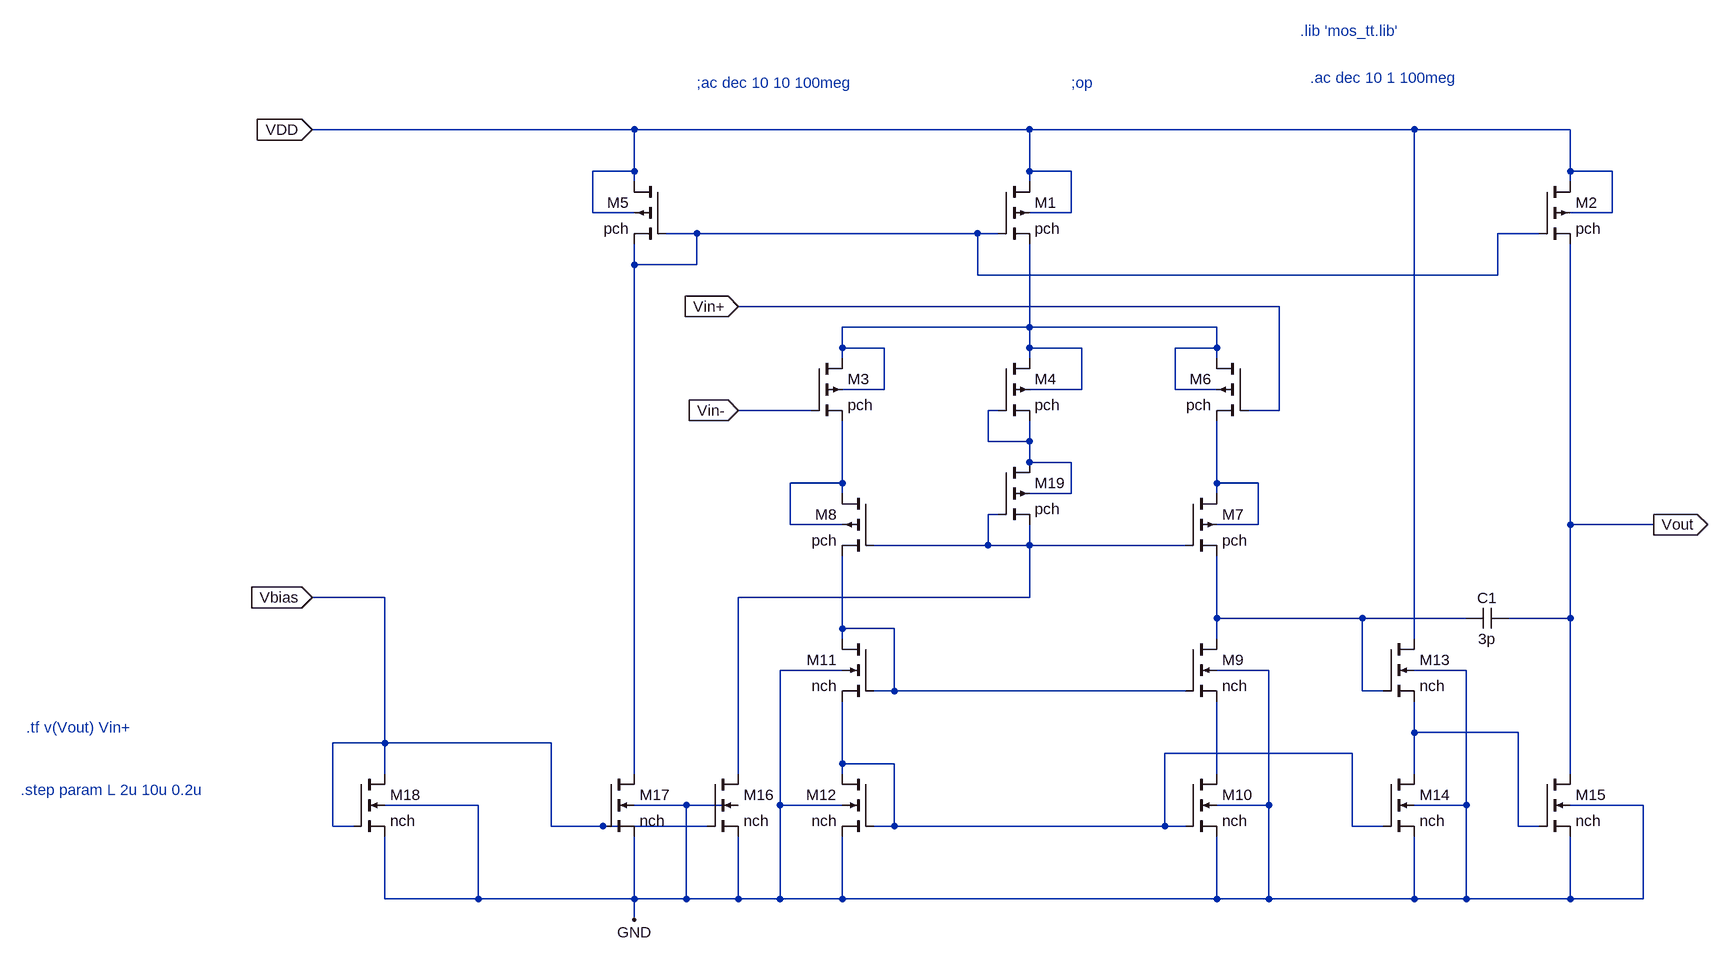
[diagram p0: schematic Opamp3u.asc]
Opamp3u.asc, the LTspice schematic file:
Version 4
SHEET 1 1400 868
WIRE -288 -368 -784 -368
WIRE 320 -368 -288 -368
WIRE 912 -368 320 -368
WIRE 1152 -368 912 -368
WIRE -288 -304 -288 -368
WIRE -288 -304 -352 -304
WIRE 320 -304 320 -368
WIRE 384 -304 320 -304
WIRE 1152 -304 1152 -368
WIRE 1216 -304 1152 -304
WIRE -288 -288 -288 -304
WIRE 320 -288 320 -304
WIRE 1152 -288 1152 -304
WIRE -352 -240 -352 -304
WIRE -288 -240 -352 -240
WIRE 384 -240 384 -304
WIRE 384 -240 320 -240
WIRE 1216 -240 1216 -304
WIRE 1216 -240 1152 -240
WIRE -192 -208 -240 -208
WIRE 240 -208 -192 -208
WIRE 272 -208 240 -208
WIRE 1104 -208 1040 -208
WIRE -288 -160 -288 -192
WIRE -192 -160 -192 -208
WIRE -192 -160 -288 -160
WIRE 240 -144 240 -208
WIRE 1040 -144 1040 -208
WIRE 1040 -144 240 -144
WIRE 704 -96 -128 -96
WIRE 320 -64 320 -192
WIRE 320 -64 32 -64
WIRE 608 -64 320 -64
WIRE 32 -32 32 -64
WIRE 96 -32 32 -32
WIRE 320 -32 320 -64
WIRE 400 -32 320 -32
WIRE 608 -32 608 -64
WIRE 608 -32 544 -32
WIRE 32 -16 32 -32
WIRE 320 -16 320 -32
WIRE 608 -16 608 -32
WIRE 96 32 96 -32
WIRE 96 32 32 32
WIRE 400 32 400 -32
WIRE 400 32 320 32
WIRE 544 32 544 -32
WIRE 608 32 544 32
WIRE -16 64 -128 64
WIRE 272 64 256 64
WIRE 704 64 704 -96
WIRE 704 64 656 64
WIRE 256 112 256 64
WIRE 320 112 320 80
WIRE 320 112 256 112
WIRE 320 144 320 112
WIRE 384 144 320 144
WIRE 32 176 32 80
WIRE 32 176 -48 176
WIRE 608 176 608 80
WIRE 672 176 608 176
WIRE 32 192 32 176
WIRE 384 192 384 144
WIRE 384 192 320 192
WIRE 608 192 608 176
WIRE 272 224 256 224
WIRE -48 240 -48 176
WIRE 32 240 -48 240
WIRE 672 240 672 176
WIRE 672 240 608 240
WIRE 1152 240 1152 -192
WIRE 1280 240 1152 240
WIRE 256 272 256 224
WIRE 256 272 80 272
WIRE 320 272 320 240
WIRE 320 272 256 272
WIRE 560 272 320 272
WIRE -672 352 -784 352
WIRE 320 352 320 272
WIRE 320 352 -128 352
WIRE 608 384 608 288
WIRE 832 384 608 384
WIRE 992 384 832 384
WIRE 1152 384 1152 240
WIRE 1152 384 1056 384
WIRE 32 400 32 288
WIRE 112 400 32 400
WIRE 32 416 32 400
WIRE 608 416 608 384
WIRE 912 416 912 -368
WIRE 32 464 -64 464
WIRE 688 464 608 464
WIRE 992 464 912 464
WIRE 112 496 112 400
WIRE 112 496 80 496
WIRE 560 496 112 496
WIRE 832 496 832 384
WIRE 864 496 832 496
WIRE 912 560 912 512
WIRE 1072 560 912 560
WIRE -672 576 -672 352
WIRE -672 576 -752 576
WIRE -416 576 -672 576
WIRE 816 592 528 592
WIRE 32 608 32 512
WIRE 112 608 32 608
WIRE -672 624 -672 576
WIRE -288 624 -288 -160
WIRE -128 624 -128 352
WIRE 32 624 32 608
WIRE 608 624 608 512
WIRE 912 624 912 560
WIRE 1152 624 1152 384
WIRE -528 672 -672 672
WIRE -208 672 -288 672
WIRE -128 672 -208 672
WIRE -64 672 -64 464
WIRE 32 672 -64 672
WIRE 688 672 688 464
WIRE 688 672 608 672
WIRE 992 672 992 464
WIRE 992 672 912 672
WIRE 1264 672 1152 672
WIRE -752 704 -752 576
WIRE -720 704 -752 704
WIRE -416 704 -416 576
WIRE -336 704 -416 704
WIRE -176 704 -336 704
WIRE 112 704 112 608
WIRE 112 704 80 704
WIRE 528 704 528 592
WIRE 528 704 112 704
WIRE 560 704 528 704
WIRE 816 704 816 592
WIRE 864 704 816 704
WIRE 1072 704 1072 560
WIRE 1104 704 1072 704
WIRE -672 816 -672 720
WIRE -528 816 -528 672
WIRE -528 816 -672 816
WIRE -288 816 -288 720
WIRE -288 816 -528 816
WIRE -208 816 -208 672
WIRE -208 816 -288 816
WIRE -128 816 -128 720
WIRE -128 816 -208 816
WIRE -64 816 -64 672
WIRE -64 816 -128 816
WIRE 32 816 32 720
WIRE 32 816 -64 816
WIRE 608 816 608 720
WIRE 608 816 32 816
WIRE 688 816 688 672
WIRE 688 816 608 816
WIRE 912 816 912 720
WIRE 912 816 688 816
WIRE 992 816 992 672
WIRE 992 816 912 816
WIRE 1152 816 1152 720
WIRE 1152 816 992 816
WIRE 1264 816 1264 672
WIRE 1264 816 1152 816
WIRE -288 848 -288 816
FLAG -288 848 GND
FLAG -128 64 Vin-
IOPIN -128 64 In
FLAG -128 -96 Vin+
IOPIN -128 -96 In
FLAG -784 -368 VDD
IOPIN -784 -368 In
FLAG 1280 240 Vout
IOPIN 1280 240 Out
FLAG -784 352 Vbias
IOPIN -784 352 In
SYMBOL pmos4 272 -288 R0
SYMATTR InstName M1
SYMATTR Value pch
SYMATTR Value2 l=3u w=150u ad=1.05e-9 as=1.05e-9 pd=164e-6 ps=164e-6
SYMBOL pmos4 1104 -288 R0
SYMATTR InstName M2
SYMATTR Value pch
SYMATTR Value2 l=3u w=150u ad=1.05e-9 as=1.05e-9 pd=164e-6 ps=164e-6 m=2
SYMBOL pmos4 -16 -16 R0
SYMATTR InstName M3
SYMATTR Value pch
SYMATTR Value2 l=3u w=75u ad=5.25e-10 as=5.25e-10 pd=89e-6 ps=89e-6
SYMBOL pmos4 272 -16 R0
SYMATTR InstName M4
SYMATTR Value pch
SYMATTR Value2 l=2u w=75u ad=5.25e-10 as=5.25e-10 pd=89e-6 ps=89e-6
SYMBOL pmos4 -240 -288 M0
SYMATTR InstName M5
SYMATTR Value pch
SYMATTR Value2 l=3u w=150u ad=1.05e-9 as=1.05e-9 pd=164e-6 ps=164e-6
SYMBOL pmos4 656 -16 M0
SYMATTR InstName M6
SYMATTR Value pch
SYMATTR Value2 l=3u w=75u ad=5.25e-10 as=5.25e-10 pd=89e-6 ps=89e-6
SYMBOL pmos4 560 192 R0
SYMATTR InstName M7
SYMATTR Value pch
SYMATTR Value2 l=4u w=75u ad=5.25e-10 as=5.25e-10 pd=89e-6 ps=89e-6
SYMBOL pmos4 80 192 M0
SYMATTR InstName M8
SYMATTR Value pch
SYMATTR Value2 l=4u w=75u ad=5.25e-10 as=5.25e-10 pd=89e-6 ps=89e-6
SYMBOL nmos4 560 416 R0
SYMATTR InstName M9
SYMATTR Value nch
SYMATTR Value2 l=3u w=50u ad=3.5e-10 as=3.5e-10 pd=64e-6 ps=64e-6
SYMBOL nmos4 560 624 R0
SYMATTR InstName M10
SYMATTR Value nch
SYMATTR Value2 l=3u w=50u ad=3.5e-10 as=3.5e-10 pd=64e-6 ps=64e-6
SYMBOL nmos4 80 416 M0
SYMATTR InstName M11
SYMATTR Value nch
SYMATTR Value2 l=3u w=50u ad=3.5e-10 as=3.5e-10 pd=64e-6 ps=64e-6
SYMBOL nmos4 80 624 M0
SYMATTR InstName M12
SYMATTR Value nch
SYMATTR Value2 l=3u w=50u ad=3.5e-10 as=3.5e-10 pd=64e-6 ps=64e-6
SYMBOL nmos4 864 416 R0
SYMATTR InstName M13
SYMATTR Value nch
SYMATTR Value2 l=3u w=50u ad=3.5e-10 as=3.5e-10 pd=64e-6 ps=64e-6
SYMBOL nmos4 864 624 R0
SYMATTR InstName M14
SYMATTR Value nch
SYMATTR Value2 l=3u w=50u ad=3.5e-10 as=3.5e-10 pd=64e-6 ps=64e-6
SYMBOL nmos4 1104 624 R0
SYMATTR InstName M15
SYMATTR Value nch
SYMATTR Value2 l=3u w=300u ad=2.1e-9 as=2.1e-9 pd=314e-6 ps=314e-6
SYMBOL cap 992 400 R270
WINDOW 0 32 32 VTop 2
WINDOW 3 0 32 VBottom 2
SYMATTR InstName C1
SYMATTR Value 3p
SYMBOL nmos4 -176 624 R0
SYMATTR InstName M16
SYMATTR Value nch
SYMATTR Value2 l=3u w=50u ad=3.5e-10 as=3.5e-10 pd=64e-6 ps=64e-6
SYMBOL nmos4 -336 624 R0
SYMATTR InstName M17
SYMATTR Value nch
SYMATTR Value2 l=3u w=100u ad=7e-10 as=7e-10 pd=114e-6 ps=114e-6
SYMBOL nmos4 -720 624 R0
SYMATTR InstName M18
SYMATTR Value nch
SYMATTR Value2 l=3u w=100u ad=7e-10 as=7e-10 pd=114e-6 ps=114e-6
SYMBOL pmos4 272 144 R0
SYMATTR InstName M19
SYMATTR Value pch
SYMATTR Value2 l=2u w=75u ad=5.25e-10 as=5.25e-10 pd=89e-6 ps=89e-6
TEXT 752 -448 Left 2 ;.ac dec 10 1 100meg
TEXT 736 -520 Left 2 ;.lib 'mos_tt.lib'
TEXT 384 -440 Left 2 ;;op
TEXT -192 -440 Left 2 ;;ac dec 10 10 100meg
TEXT -1224 552 Left 2 ;.tf v(Vout) Vin+
TEXT -1232 648 Left 2 ;.step param L 2u 10u 0.2u

The netlist it stands for:
* Opamp3u.asc
M1 VDD N001 N002 VDD pch l=3u w=150u ad=1.05e-9 as=1.05e-9 pd=164e-6 ps=164e-6
M2 VDD N001 Vout VDD pch l=3u w=150u ad=1.05e-9 as=1.05e-9 pd=164e-6 ps=164e-6 m=2
M3 N002 Vin- N004 N002 pch l=3u w=75u ad=5.25e-10 as=5.25e-10 pd=89e-6 ps=89e-6
M4 N002 N003 N003 N002 pch l=2u w=75u ad=5.25e-10 as=5.25e-10 pd=89e-6 ps=89e-6
M5 VDD N001 N001 VDD pch l=3u w=150u ad=1.05e-9 as=1.05e-9 pd=164e-6 ps=164e-6
M6 N002 Vin+ N005 N002 pch l=3u w=75u ad=5.25e-10 as=5.25e-10 pd=89e-6 ps=89e-6
M7 N005 N006 N007 N005 pch l=4u w=75u ad=5.25e-10 as=5.25e-10 pd=89e-6 ps=89e-6
M8 N004 N006 N008 N004 pch l=4u w=75u ad=5.25e-10 as=5.25e-10 pd=89e-6 ps=89e-6
M9 N007 N008 N011 GND nch l=3u w=50u ad=3.5e-10 as=3.5e-10 pd=64e-6 ps=64e-6
M10 N011 N010 GND GND nch l=3u w=50u ad=3.5e-10 as=3.5e-10 pd=64e-6 ps=64e-6
M11 N008 N008 N010 GND nch l=3u w=50u ad=3.5e-10 as=3.5e-10 pd=64e-6 ps=64e-6
M12 N010 N010 GND GND nch l=3u w=50u ad=3.5e-10 as=3.5e-10 pd=64e-6 ps=64e-6
M13 VDD N007 N009 GND nch l=3u w=50u ad=3.5e-10 as=3.5e-10 pd=64e-6 ps=64e-6
M14 N009 N010 GND GND nch l=3u w=50u ad=3.5e-10 as=3.5e-10 pd=64e-6 ps=64e-6
M15 Vout N009 GND GND nch l=3u w=300u ad=2.1e-9 as=2.1e-9 pd=314e-6 ps=314e-6
C1 N007 Vout 3p
M16 N006 Vbias GND GND nch l=3u w=50u ad=3.5e-10 as=3.5e-10 pd=64e-6 ps=64e-6
M17 N001 Vbias GND GND nch l=3u w=100u ad=7e-10 as=7e-10 pd=114e-6 ps=114e-6
M18 Vbias Vbias GND GND nch l=3u w=100u ad=7e-10 as=7e-10 pd=114e-6 ps=114e-6
M19 N003 N006 N006 N003 pch l=2u w=75u ad=5.25e-10 as=5.25e-10 pd=89e-6 ps=89e-6
.model NMOS NMOS
.model PMOS PMOS
.lib standard.mos
* .ac dec 10 1 100meg
* .lib 'mos_tt.lib'
* ;op
* ;ac dec 10 10 100meg
* .tf v(Vout) Vin+
* .step param L 2u 10u 0.2u
.backanno
.end